# Altium project STM32F429VET6_SRK1201L.PrjPCB
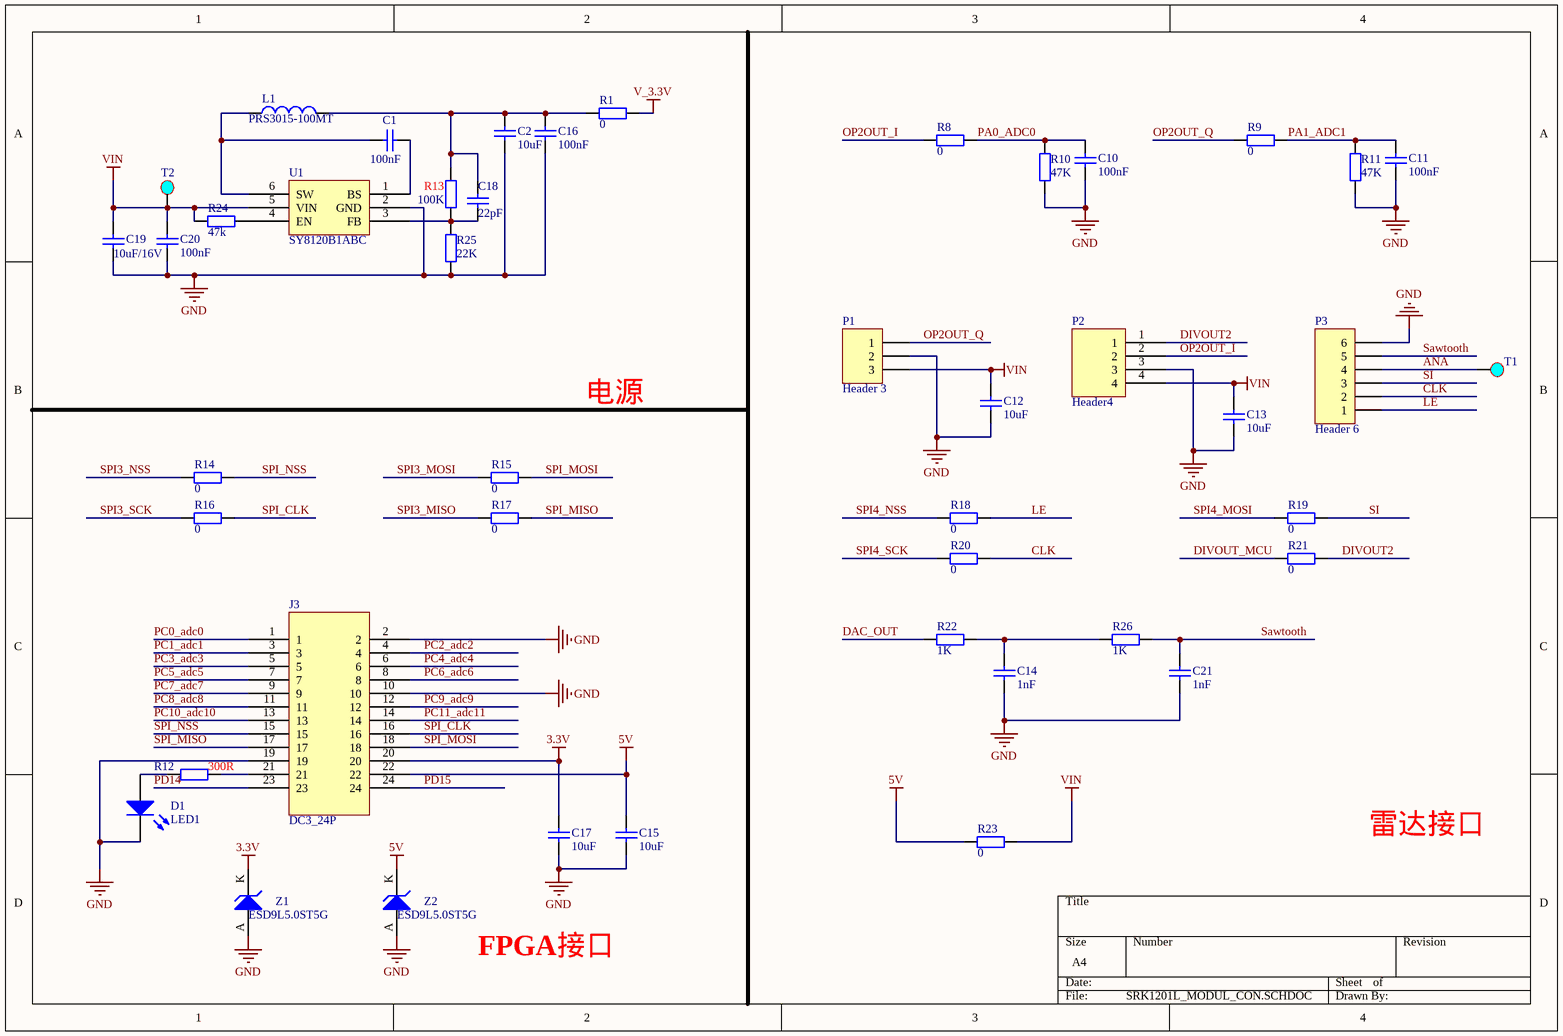
[diagram p0: SRK1201L_MODUL_CON.SCHDOC]
3 sheets, 125 parts. Net scope: global (net labels, ports and power ports of the same name join across sheets).
Board file: STM32F429VET6_SRK1201L.PcbDoc
Sheets:
  SRK1201L_MODUL_CON.SCHDOC
  STM32F429VET6.SchDoc
  USB3300-EZK-PHY.SchDoc

## Sheet SRK1201L_MODUL_CON.SCHDOC
size A4

### Parts
C1  100nF  [C0402]
C2  10uF  [C0603]
C10  100nF  [C0402]
C11  100nF  [C0402]
C12  10uF  [C0603]
C13  10uF  [C0603]
C14  1nF  [C0402]
C15  10uF  [C0603]
C16  100nF  [C0402]
C17  10uF  [C0603]
C18  22pF  [C0402]
C19  10uF/16V  [C0603]
C20  100nF  [C0402]
C21  1nF  [C0402]
D1  LED1  [LED-0603]
J3  DC3_24P  [CON2.0-12X2 -SWAP]
L1  PRS3015-100MT  [PRS3015]
P1  Header 3  [HDR1X3-2.54]
P2  Header4  [J4]
P3  Header 6  [HDR1X6]
R1  0  [R0402]
R8  0  [R0402]
R9  0  [R0402]
R10  47K  [R0402]
R11  47K  [R0402]
R12  300R  [R0402]
R13  100K  [R0402]
R14  0  [R0402]
R15  0  [R0402]
R16  0  [R0402]
R17  0  [R0402]
R18  0  [R0402]
R19  0  [R0402]
R20  0  [R0402]
R21  0  [R0402]
R22  1K  [R0402]
R23  0  [R0402]
R24  47k  [R0402]
R25  22K  [R0402]
R26  1K  [R0402]
T1  (no value)  [TestPoints]
T2  (no value)  [TestPoints-0.7]
U1  SY8120B1ABC  [SOT-23-6]
Z1  ESD9L5.0ST5G  [SOD-923]
Z2  ESD9L5.0ST5G  [SOD-923]

### Nets
3.3V: C17.1 J3.20 Z1.K
5V: C15.1 J3.22 R23.2 Z2.K
GND: C2.2 C10.2 C11.2 C12.2 C13.2 C14.2 C15.2 C16.1 C17.2 C19.2 C20.1 C21.2 D1.2(K) J3.2 J3.10 J3.19 P1.2 P2.3 P3.6 R10.1 R11.1 R25.1 U1.2(GND) Z1.A Z2.A
V_3.3V: R1.1
VIN: C12.1 C13.1 C19.1 C20.2 P1.3 P2.4 R23.1 R24.2 T2.1 U1.5(VIN)
ANA: P3.4 T1.1
CLK: P3.2 R20.1
DAC_OUT: R22.2
DIVOUT2: P2.1 R21.1
DIVOUT_MCU: R21.2
LE: P3.1 R18.1
OP2OUT_I: P2.2 R8.2
OP2OUT_Q: P1.1 R9.2
PA0_ADC0: C10.1 R8.1 R10.2
PA1_ADC1: C11.1 R9.1 R11.2
PC0_adc0: J3.1
PC1_adc1: J3.3
PC2_adc2: J3.4
PC3_adc3: J3.5
PC4_adc4: J3.6
PC5_adc5: J3.7
PC6_adc6: J3.8
PC7_adc7: J3.9
PC8_adc8: J3.11
PC9_adc9: J3.12
PC10_adc10: J3.13
PC11_adc11: J3.14
PD14: J3.23
PD15: J3.24
Sawtooth: C21.1 P3.5 R26.1
SI: P3.3 R19.1
SPI3_MISO: R17.2
SPI3_MOSI: R15.2
SPI3_NSS: R14.2
SPI3_SCK: R16.2
SPI4_MOSI: R19.2
SPI4_NSS: R18.2
SPI4_SCK: R20.2
SPI_CLK: J3.16 R16.1
SPI_MISO: J3.17 R17.1
SPI_MOSI: J3.18 R15.1
SPI_NSS: J3.15 R14.1
NetC1_1: C1.1 L1.1 U1.6(SW)
NetC1_2: C1.2 U1.1(BS)
NetC2_1: C2.1 C16.2 C18.2 L1.2 R1.2 R13.2
NetC14_1: C14.1 R22.1 R26.2
NetC18_1: C18.1 R13.1 R25.2 U1.3(FB)
NetD1_1: D1.1(A) R12.2
NetJ3_21: J3.21 R12.1
NetR24_1: R24.1 U1.4(EN)

### Notes on the sheet
- 电源
- 雷达接口
- FPGA接口

### Library data of the parts
C1 C2 C10-C21 = Cap: Capacitor; Published: 8-Jun-2000; LatestRevisionDate: 17-Jul-2002; LatestRevisionNote: Re-released for DXP Platform.; PackageReference: RAD-0.3; Publisher: Altium Limited; PackageDescription: Radial Cap, Thru-Hole; 2 Leads; 0.3 in Pin Spacing
  C1 C10 C11 C16 C20: Value: 100nF
  C2 C12 C13 C15 C17: Value: 10uF
  C14 C21: Value: 1nF
  C18: Value: 22pF
  C19: Value: 10uF/16V
D1 = LED1: Typical RED GaAs LED; Published: 8-Jun-2000; LatestRevisionDate: 08-Jul-2005; LatestRevisionNote: Mech Layer 1 removed.; PackageReference: LED-1; Publisher: Altium Limited; PackageDescription: LED; 2 Leads
L1 = Inductor: Code_IEC: 1005; Published: 8-Jun-2000; LatestRevisionDate: 29-May-2009; LatestRevisionNote: IPC-7351 Footprint Added.; PackageReference: 0402-A; Publisher: Altium Limited; PackageDescription: Chip Inductor; Code_JEITA: 0402; Value: PRS3015-100MT
P1 = Header 3: Header, 3-Pin; LatestRevisionDate: 17-Jul-2002; LatestRevisionNote: Re-released for DXP Platform.; Publisher: Altium Limited
P2 = J4
P3 = Header 6: Header, 6-Pin; LatestRevisionDate: 17-Jul-2002; LatestRevisionNote: Re-released for DXP Platform.; Publisher: Altium Limited
R1 R8-R26 = Res2: Resistor; Published: 8-Jun-2000; LatestRevisionDate: 17-Jul-2002; LatestRevisionNote: Re-released for DXP Platform.; PackageReference: AXIAL-0.4; Publisher: Altium Limited; PackageDescription: Axial Device, Thru-Hole; 2 Leads; 0.4 in Pin Spacing
  R1 R8 R9 R14-R21 R23: Value: 0
  R10 R11: Value: 47K
  R12: Value: 300R
  R13: Value: 100K
  R22 R26: Value: 1K
  R24: Value: 47k
  R25: Value: 22K
T1 T2 = TestPoints
U1 = H9108
Z1 Z2 = D Zener: Zener Diode; Published: 8-Jun-2000; LatestRevisionDate: 17-Jul-2002; LatestRevisionNote: Re-released for DXP Platform.; PackageReference: DIODE-0.7; Publisher: Altium Limited; PackageDescription: Diode, Thru-Hole; 2 Leads; 0.7 in Pin Spacing

## Sheet STM32F429VET6.SchDoc
size A4
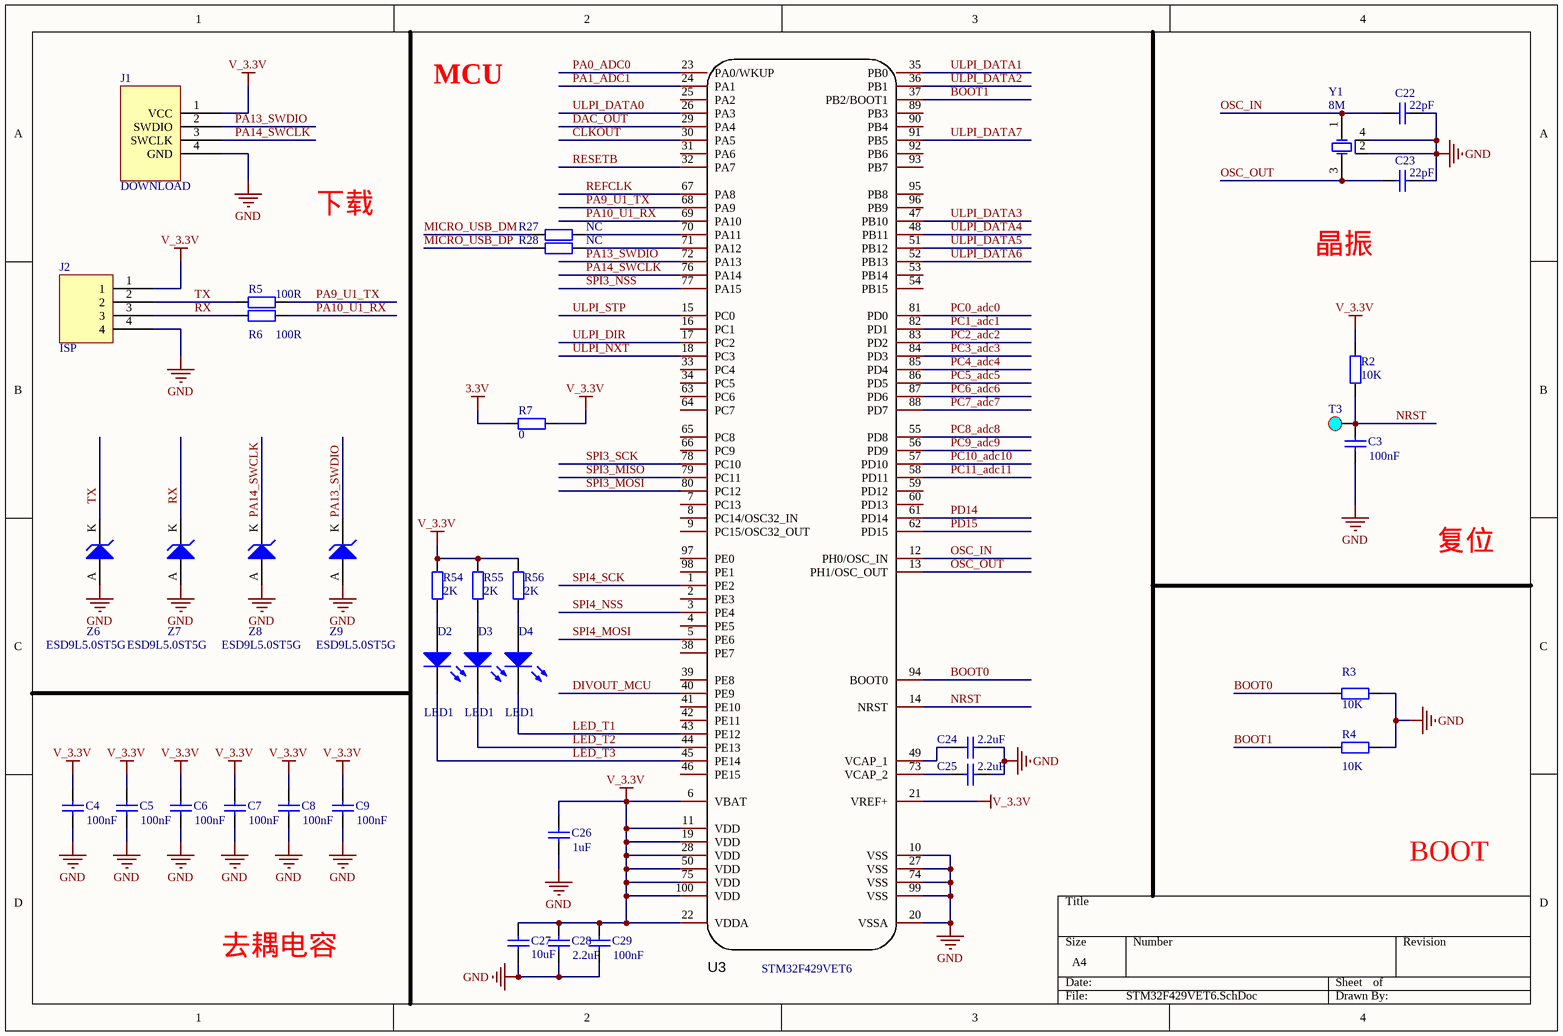
[diagram p1: STM32F429VET6.SchDoc]

### Parts
C3  100nF  [C0402]
C4  100nF  [C0402]
C5  100nF  [C0402]
C6  100nF  [C0402]
C7  100nF  [C0402]
C8  100nF  [C0402]
C9  100nF  [C0402]
C22  22pF  [C0402]
C23  22pF  [C0402]
C24  2.2uF  [C0402]
C25  2.2uF  [C0402]
C26  1uF  [C0402]
C27  10uF  [C0603]
C28  2.2uF  [C0402]
C29  100nF  [C0402]
D2  LED1  [LED-0603]
D3  LED1  [LED-0603]
D4  LED1  [LED-0603]
J1  DOWNLOAD  [J4]
J2  ISP  [J4]
R2  10K  [R0402]
R3  10K  [R0402]
R4  10K  [R0402]
R5  100R  [R0402]
R6  100R  [R0402]
R7  0  [R0402]
R27  NC  [R0402]
R28  NC  [R0402]
R54  2K  [R0402]
R55  2K  [R0402]
R56  2K  [R0402]
T3  (no value)  [TestPoints-0.7]
U3  STM32F429VET6  [LQFP-100_L14.0-W14.0-P0.50-LS16.0-BL]
Y1  8M  [CRYSTAL_3.2*2.5]
Z6  ESD9L5.0ST5G  [SOD-923]
Z7  ESD9L5.0ST5G  [SOD-923]
Z8  ESD9L5.0ST5G  [SOD-923]
Z9  ESD9L5.0ST5G  [SOD-923]

### Nets
3.3V: R7.2
GND: C3.2 C4.2 C5.2 C6.2 C7.2 C8.2 C9.2 C22.2 C23.2 C24.2 C25.2 C26.2 C27.2 C28.2 C29.2 J1.4(GND) J2.4 R3.2 R4.1 U3.10(VSS) U3.20(VSSA) U3.27(VSS) U3.74(VSS) U3.99(VSS) Y1.2(GROUND) Y1.4(GROUND) Z6.A Z7.A Z8.A Z9.A
V_3.3V: C4.1 C5.1 C6.1 C7.1 C8.1 C9.1 C26.1 C27.1 C28.1 C29.1 J1.1(VCC) J2.1 R2.1 R7.1 R54.1 R55.1 R56.1 U3.6(VBAT) U3.11(VDD) U3.19(VDD) U3.21(VREF+) U3.22(VDDA) U3.28(VDD) U3.50(VDD) U3.75(VDD) U3.100(VDD)
BOOT0: R3.1 U3.94(BOOT0)
BOOT1: R4.2 U3.37(PB2/BOOT1)
CLKOUT: U3.30(PA5)
DAC_OUT: U3.29(PA4)
DIVOUT_MCU: U3.40(PE9)
LED_T1: D4.2(K) U3.43(PE12)
LED_T2: D3.2(K) U3.44(PE13)
LED_T3: D2.2(K) U3.45(PE14)
MICRO_USB_DM: R27.2
MICRO_USB_DP: R28.2
NRST: C3.1 R2.2 T3.1 U3.14(NRST)
OSC_IN: C22.1 U3.12(PH0/OSC_IN) Y1.1(INPUT)
OSC_OUT: C23.1 U3.13(PH1/OSC_OUT) Y1.3(OUTPUT)
PA0_ADC0: U3.23(PA0/WKUP)
PA1_ADC1: U3.24(PA1)
PA9_U1_TX: R5.1 U3.68(PA9)
PA10_U1_RX: R6.1 U3.69(PA10)
PA13_SWDIO: J1.2(SWDIO) U3.72(PA13) Z9.K
PA14_SWCLK: J1.3(SWCLK) U3.76(PA14) Z8.K
PC0_adc0: U3.81(PD0)
PC1_adc1: U3.82(PD1)
PC2_adc2: U3.83(PD2)
PC3_adc3: U3.84(PD3)
PC4_adc4: U3.85(PD4)
PC5_adc5: U3.86(PD5)
PC6_adc6: U3.87(PD6)
PC7_adc7: U3.88(PD7)
PC8_adc8: U3.55(PD8)
PC9_adc9: U3.56(PD9)
PC10_adc10: U3.57(PD10)
PC11_adc11: U3.58(PD11)
PD14: U3.61(PD14)
PD15: U3.62(PD15)
REFCLK: U3.67(PA8)
RESETB: U3.32(PA7)
RX: J2.3 R6.2 Z7.K
SPI3_MISO: U3.79(PC11)
SPI3_MOSI: U3.80(PC12)
SPI3_NSS: U3.77(PA15)
SPI3_SCK: U3.78(PC10)
SPI4_MOSI: U3.5(PE6)
SPI4_NSS: U3.3(PE4)
SPI4_SCK: U3.1(PE2)
TX: J2.2 R5.2 Z6.K
ULPI_DATA0: U3.26(PA3)
ULPI_DATA1: U3.35(PB0)
ULPI_DATA2: U3.36(PB1)
ULPI_DATA3: U3.47(PB10)
ULPI_DATA4: U3.48(PB11)
ULPI_DATA5: U3.51(PB12)
ULPI_DATA6: U3.52(PB13)
ULPI_DATA7: U3.91(PB5)
ULPI_DIR: U3.17(PC2)
ULPI_NXT: U3.18(PC3)
ULPI_STP: U3.15(PC0)
NetC24_1: C24.1 U3.49(VCAP_1)
NetC25_1: C25.1 U3.73(VCAP_2)
NetD2_1: D2.1(A) R54.2
NetD3_1: D3.1(A) R55.2
NetD4_1: D4.1(A) R56.2
NetR27_1: R27.1 U3.70(PA11)
NetR28_1: R28.1 U3.71(PA12)

Not connected (* = marked no-connect by the designer): U3 2(PE3) 4(PE5) 7(PC13) 8(PC14/OSC32_IN) 9(PC15/OSC32_OUT) 16(PC1) 25(PA2) 31(PA6) 33(PC4) 34(PC5) 38(PE7) 39(PE8) 41(PE10) 42(PE11) 46(PE15) 53(PB14) 54(PB15) 59(PD12) 60(PD13) 63(PC6) 64(PC7) 65(PC8) 66(PC9) 89(PB3) 90(PB4) 92(PB6) 93(PB7) 95(PB8) 96(PB9) 97(PE0) 98(PE1)

### Notes on the sheet
- MCU
- 下载
- 晶振
- 复位
- BOOT
- 去耦电容

### Library data of the parts
C3-C9 C22-C29 = Cap: Capacitor; Published: 8-Jun-2000; LatestRevisionDate: 17-Jul-2002; LatestRevisionNote: Re-released for DXP Platform.; PackageReference: RAD-0.3; Publisher: Altium Limited; PackageDescription: Radial Cap, Thru-Hole; 2 Leads; 0.3 in Pin Spacing
  C3-C9 C29: Value: 100nF
  C22 C23: Value: 22pF
  C24 C25 C28: Value: 2.2uF
  C26: Value: 1uF
  C27: Value: 10uF
D2-D4 = LED1: Typical RED GaAs LED; Published: 8-Jun-2000; LatestRevisionDate: 08-Jul-2005; LatestRevisionNote: Mech Layer 1 removed.; PackageReference: LED-1; Publisher: Altium Limited; PackageDescription: LED; 2 Leads
J1 = 下载
J2 = J4
R2-R7 R27 R28 R54-R56 = Res2: Resistor; Published: 8-Jun-2000; LatestRevisionDate: 17-Jul-2002; LatestRevisionNote: Re-released for DXP Platform.; PackageReference: AXIAL-0.4; Publisher: Altium Limited; PackageDescription: Axial Device, Thru-Hole; 2 Leads; 0.4 in Pin Spacing
  R2-R4: Value: 10K
  R5 R6: Value: 100R
  R7: Value: 0
  R27 R28: Value: NC
  R54-R56: Value: 2K
T3 = TestPoints
U3 = STM32F429VET6: Manufacturer: ST(意法半导体); Add into BOM: yes; Speed: 180MHz; Voltage - Supply (Vcc/Vdd): 1.8V ~ 3.6V; Program Memory Size: 512KB; RAM Size: 256KB; Number of I/O: 82; A/D: 16x12bit; D/A: 2x12bit; PWM: 56; LCD: LCD TFT Controller up to 1024x728; UART/USART: 4 USART+4 UART; SPI: 4; I2C（SMBUS/PMBUS）: 3; USB Device: 1; CAN: 2; Ethernet: 10/100 Ethernet MAC; Name: STM32F429VET6; Symbol: STM32F429VET6; Device: STM32F429VET6; LCSC Part Name: STM32F429VET6; Supplier Part: C95447; Manufacturer Part: STM32F429VET6; Supplier Footprint: LQFP-100_14x14x05P; JLCPCB Part Class: Extended Part; Datasheet: https://atta.szlcsc.com/upload/public/pdf/source/20170918/C95447_1505700207508975047.pdf; Supplier: LCSC; Convert to PCB: yes; USB Host/OTG: 1; Features: I2S,SAI
Y1 = CRYSTAL-PASSIVE_3225
Z6-Z9 = D Zener: Zener Diode; Published: 8-Jun-2000; LatestRevisionDate: 17-Jul-2002; LatestRevisionNote: Re-released for DXP Platform.; PackageReference: DIODE-0.7; Publisher: Altium Limited; PackageDescription: Diode, Thru-Hole; 2 Leads; 0.7 in Pin Spacing

## Sheet USB3300-EZK-PHY.SchDoc
size A4
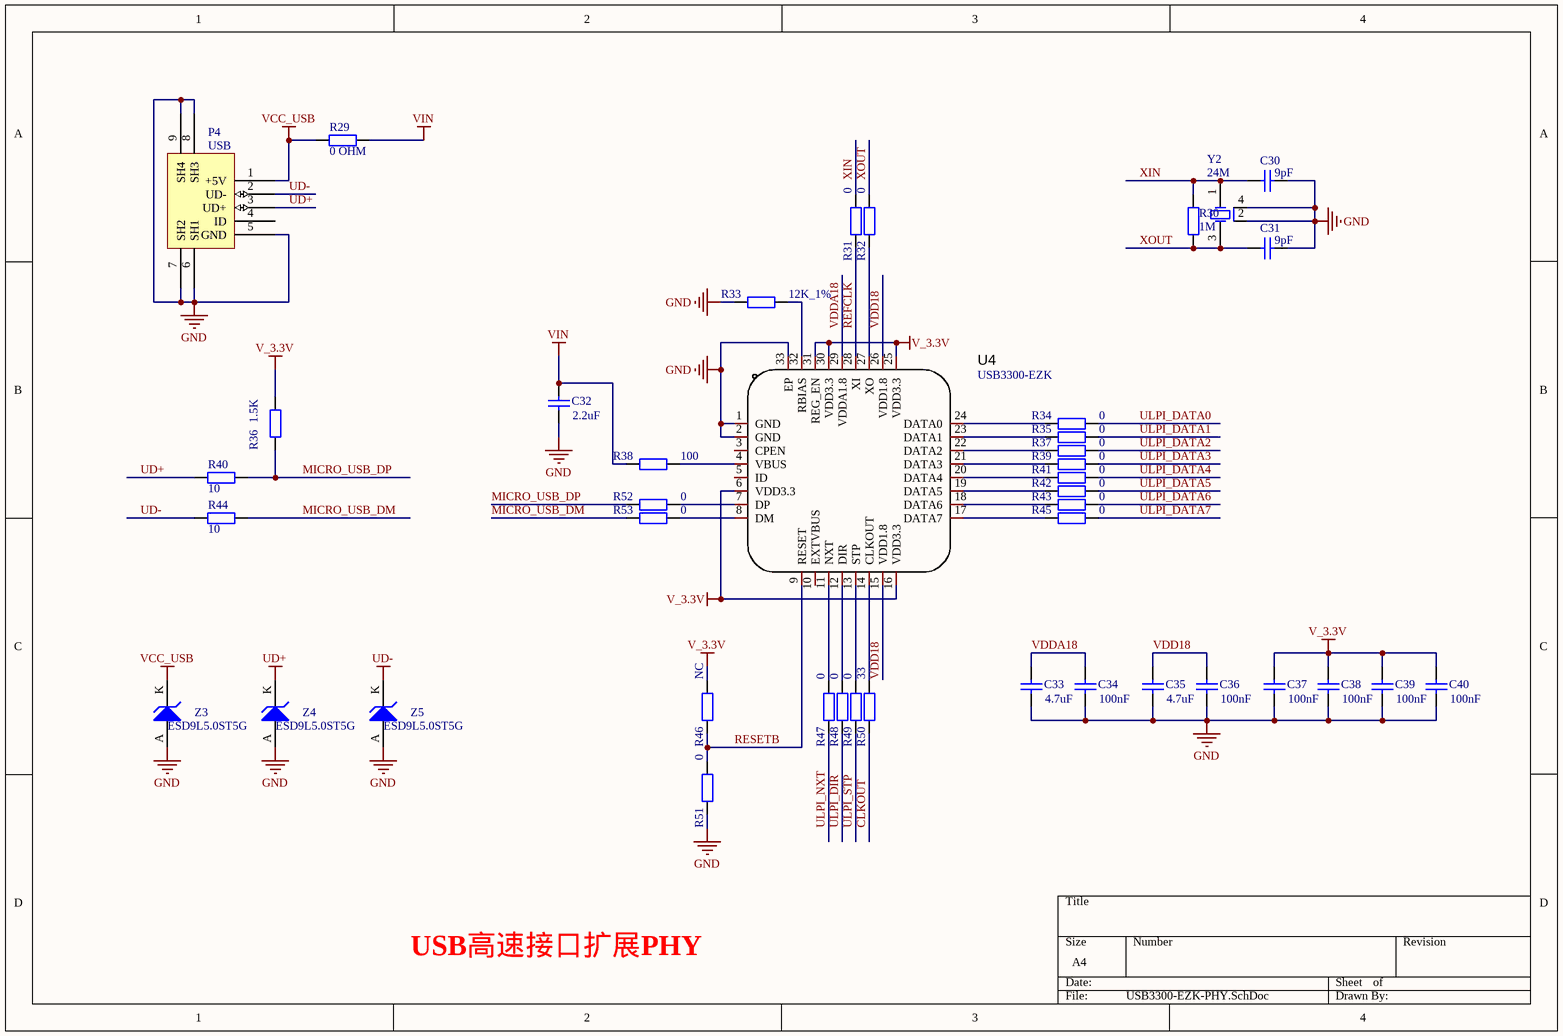
[diagram p2: USB3300-EZK-PHY.SchDoc]

### Parts
C30  9pF  [C0402]
C31  9pF  [C0402]
C32  2.2uF  [C0402]
C33  4.7uF  [C0402]
C34  100nF  [C0402]
C35  4.7uF  [C0402]
C36  100nF  [C0402]
C37  100nF  [C0402]
C38  100nF  [C0402]
C39  100nF  [C0402]
C40  100nF  [C0402]
P4  USB  [USB 牛角头]
R29  0 OHM  [R0402]
R30  1M  [R0402]
R31  0  [R0402]
R32  0  [R0402]
R33  12K_1%  [R0402]
R34  0  [R0402]
R35  0  [R0402]
R36  1.5K  [R0402]
R37  0  [R0402]
R38  100  [R0402]
R39  0  [R0402]
R40  10  [R0402]
R41  0  [R0402]
R42  0  [R0402]
R43  0  [R0402]
R44  10  [R0402]
R45  0  [R0402]
R46  NC  [R0402]
R47  0  [R0402]
R48  0  [R0402]
R49  0  [R0402]
R50  33  [R0402]
R51  0  [R0402]
R52  0  [R0402]
R53  0  [R0402]
U4  USB3300-EZK  [QFN-32_L5.0-W5.0-P0.50-BL-EP3.4]
Y2  24M  [CRYSTAL_3.2*2.5]
Z3  ESD9L5.0ST5G  [SOD-923]
Z4  ESD9L5.0ST5G  [SOD-923]
Z5  ESD9L5.0ST5G  [SOD-923]

### Nets
GND: C30.2 C31.2 C32.2 C33.2 C34.2 C35.2 C36.2 C37.2 C38.2 C39.2 C40.2 P4.5(GND) P4.6(SH1) P4.7(SH2) P4.8(SH3) P4.9(SH4) R33.2 R51.2 U4.1(GND) U4.2(GND) U4.33(EP) Y2.2(GROUND) Y2.4(GROUND) Z3.A Z4.A Z5.A
UD+: P4.3(UD+) R40.1 Z4.K
UD-: P4.2(UD-) R44.1 Z5.K
V_3.3V: C37.1 C38.1 C39.1 C40.1 R36.1 R46.1 U4.6(VDD3.3) U4.16(VDD3.3) U4.25(VDD3.3) U4.30(VDD3.3) U4.31(REG_EN)
VCC_USB: P4.1(+5V) R29.2 Z3.K
VIN: C32.1 R29.1 R38.2
CLKOUT: R50.2
MICRO_USB_DM: R44.2 R53.1
MICRO_USB_DP: R36.2 R40.2 R52.1
REFCLK: R31.2 U4.28(XI)
RESETB: R46.2 R51.1 U4.9(RESET)
ULPI_DATA0: R34.1
ULPI_DATA1: R35.1
ULPI_DATA2: R37.1
ULPI_DATA3: R39.1
ULPI_DATA4: R41.1
ULPI_DATA5: R42.1
ULPI_DATA6: R43.1
ULPI_DATA7: R45.1
ULPI_DIR: R48.2
ULPI_NXT: R47.2
ULPI_STP: R49.2
VDD18: C35.1 C36.1 U4.15(VDD1.8) U4.26(VDD1.8)
VDDA18: C33.1 C34.1 U4.29(VDDA1.8)
XIN: C30.1 R30.2 R31.1 Y2.1(INPUT)
XOUT: C31.1 R30.1 R32.1 Y2.3(OUTPUT)
NetR32_2: R32.2 U4.27(XO)
NetR33_1: R33.1 U4.32(RBIAS)
NetR34_2: R34.2 U4.24(DATA0)
NetR35_2: R35.2 U4.23(DATA1)
NetR37_2: R37.2 U4.22(DATA2)
NetR38_1: R38.1 U4.4(VBUS)
NetR39_2: R39.2 U4.21(DATA3)
NetR41_2: R41.2 U4.20(DATA4)
NetR42_2: R42.2 U4.19(DATA5)
NetR43_2: R43.2 U4.18(DATA6)
NetR45_2: R45.2 U4.17(DATA7)
NetR47_1: R47.1 U4.11(NXT)
NetR48_1: R48.1 U4.12(DIR)
NetR49_1: R49.1 U4.13(STP)
NetR50_1: R50.1 U4.14(CLKOUT)
NetR52_2: R52.2 U4.7(DP)
NetR53_2: R53.2 U4.8(DM)

Not connected (* = marked no-connect by the designer): P4 4(ID); U4 3(CPEN) 5(ID) 10(EXTVBUS)

### Notes on the sheet
- USB高速接口扩展PHY

### Library data of the parts
C30-C40 = Cap: Capacitor; Published: 8-Jun-2000; LatestRevisionDate: 17-Jul-2002; LatestRevisionNote: Re-released for DXP Platform.; PackageReference: RAD-0.3; Publisher: Altium Limited; PackageDescription: Radial Cap, Thru-Hole; 2 Leads; 0.3 in Pin Spacing
  C30 C31: Value: 9pF
  C32: Value: 2.2uF
  C33 C35: Value: 4.7uF
  C34 C36-C40: Value: 100nF
R29-R53 = Res2: Resistor; Published: 8-Jun-2000; LatestRevisionDate: 17-Jul-2002; LatestRevisionNote: Re-released for DXP Platform.; PackageReference: AXIAL-0.4; Publisher: Altium Limited; PackageDescription: Axial Device, Thru-Hole; 2 Leads; 0.4 in Pin Spacing
  R29: Value: 0 OHM
  R30: Value: 1M
  R31 R32 R34 R35 R37 R39 R41-R43 R45 R47-R49 R51-R53: Value: 0
  R33: Value: 12K_1%
  R36: Value: 1.5K
  R38: Value: 100
  R40 R44: Value: 10
  R46: Value: NC
  R50: Value: 33
U4 = USB3300-EZK: Manufacturer: MICROCHIP(美国微芯); Add into BOM: yes; Name: USB3300-EZK; Symbol: USB3300-EZK; Device: USB3300-EZK; LCSC Part Name: USB3300-EZK; Supplier Part: C108954; Manufacturer Part: USB3300-EZK; Supplier Footprint: QFN-32_5x5x05P; JLCPCB Part Class: Extended Part; Datasheet: https://atta.szlcsc.com/upload/public/pdf/source/20170620/1497944729272.pdf; Supplier: LCSC; Convert to PCB: yes
Y2 = CRYSTAL-PASSIVE_3225
Z3-Z5 = D Zener: Zener Diode; Published: 8-Jun-2000; LatestRevisionDate: 17-Jul-2002; LatestRevisionNote: Re-released for DXP Platform.; PackageReference: DIODE-0.7; Publisher: Altium Limited; PackageDescription: Diode, Thru-Hole; 2 Leads; 0.7 in Pin Spacing

## Nets that join several sheets
3.3V: SRK1201L_MODUL_CON (C17.1 J3.20 Z1.K), STM32F429VET6 (R7.2)
GND: SRK1201L_MODUL_CON (25 pins), STM32F429VET6 (30 pins), USB3300-EZK-PHY (26 pins)
V_3.3V: SRK1201L_MODUL_CON (R1.1), STM32F429VET6 (26 pins), USB3300-EZK-PHY (11 pins)
VIN: SRK1201L_MODUL_CON (10 pins), USB3300-EZK-PHY (C32.1 R29.1 R38.2)
CLKOUT: STM32F429VET6 (U3.30), USB3300-EZK-PHY (R50.2)
DAC_OUT: SRK1201L_MODUL_CON (R22.2), STM32F429VET6 (U3.29)
DIVOUT_MCU: SRK1201L_MODUL_CON (R21.2), STM32F429VET6 (U3.40)
MICRO_USB_DM: STM32F429VET6 (R27.2), USB3300-EZK-PHY (R44.2 R53.1)
MICRO_USB_DP: STM32F429VET6 (R28.2), USB3300-EZK-PHY (R36.2 R40.2 R52.1)
PA0_ADC0: SRK1201L_MODUL_CON (C10.1 R8.1 R10.2), STM32F429VET6 (U3.23)
PA1_ADC1: SRK1201L_MODUL_CON (C11.1 R9.1 R11.2), STM32F429VET6 (U3.24)
PC0_adc0: SRK1201L_MODUL_CON (J3.1), STM32F429VET6 (U3.81)
PC1_adc1: SRK1201L_MODUL_CON (J3.3), STM32F429VET6 (U3.82)
PC2_adc2: SRK1201L_MODUL_CON (J3.4), STM32F429VET6 (U3.83)
PC3_adc3: SRK1201L_MODUL_CON (J3.5), STM32F429VET6 (U3.84)
PC4_adc4: SRK1201L_MODUL_CON (J3.6), STM32F429VET6 (U3.85)
PC5_adc5: SRK1201L_MODUL_CON (J3.7), STM32F429VET6 (U3.86)
PC6_adc6: SRK1201L_MODUL_CON (J3.8), STM32F429VET6 (U3.87)
PC7_adc7: SRK1201L_MODUL_CON (J3.9), STM32F429VET6 (U3.88)
PC8_adc8: SRK1201L_MODUL_CON (J3.11), STM32F429VET6 (U3.55)
PC9_adc9: SRK1201L_MODUL_CON (J3.12), STM32F429VET6 (U3.56)
PC10_adc10: SRK1201L_MODUL_CON (J3.13), STM32F429VET6 (U3.57)
PC11_adc11: SRK1201L_MODUL_CON (J3.14), STM32F429VET6 (U3.58)
PD14: SRK1201L_MODUL_CON (J3.23), STM32F429VET6 (U3.61)
PD15: SRK1201L_MODUL_CON (J3.24), STM32F429VET6 (U3.62)
REFCLK: STM32F429VET6 (U3.67), USB3300-EZK-PHY (R31.2 U4.28)
RESETB: STM32F429VET6 (U3.32), USB3300-EZK-PHY (R46.2 R51.1 U4.9)
SPI3_MISO: SRK1201L_MODUL_CON (R17.2), STM32F429VET6 (U3.79)
SPI3_MOSI: SRK1201L_MODUL_CON (R15.2), STM32F429VET6 (U3.80)
SPI3_NSS: SRK1201L_MODUL_CON (R14.2), STM32F429VET6 (U3.77)
SPI3_SCK: SRK1201L_MODUL_CON (R16.2), STM32F429VET6 (U3.78)
SPI4_MOSI: SRK1201L_MODUL_CON (R19.2), STM32F429VET6 (U3.5)
SPI4_NSS: SRK1201L_MODUL_CON (R18.2), STM32F429VET6 (U3.3)
SPI4_SCK: SRK1201L_MODUL_CON (R20.2), STM32F429VET6 (U3.1)
ULPI_DATA0: STM32F429VET6 (U3.26), USB3300-EZK-PHY (R34.1)
ULPI_DATA1: STM32F429VET6 (U3.35), USB3300-EZK-PHY (R35.1)
ULPI_DATA2: STM32F429VET6 (U3.36), USB3300-EZK-PHY (R37.1)
ULPI_DATA3: STM32F429VET6 (U3.47), USB3300-EZK-PHY (R39.1)
ULPI_DATA4: STM32F429VET6 (U3.48), USB3300-EZK-PHY (R41.1)
ULPI_DATA5: STM32F429VET6 (U3.51), USB3300-EZK-PHY (R42.1)
ULPI_DATA6: STM32F429VET6 (U3.52), USB3300-EZK-PHY (R43.1)
ULPI_DATA7: STM32F429VET6 (U3.91), USB3300-EZK-PHY (R45.1)
ULPI_DIR: STM32F429VET6 (U3.17), USB3300-EZK-PHY (R48.2)
ULPI_NXT: STM32F429VET6 (U3.18), USB3300-EZK-PHY (R47.2)
ULPI_STP: STM32F429VET6 (U3.15), USB3300-EZK-PHY (R49.2)